# EAGLE design Eagle_Button (EAGLE 7.2.0)
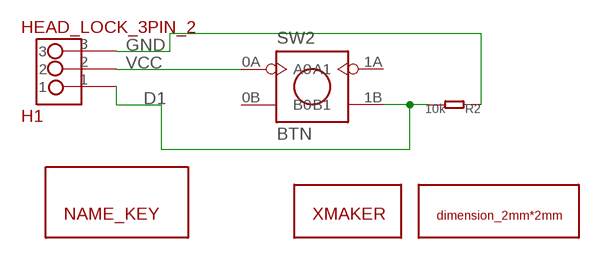
[diagram p0: schematic, sheet 1]

## Parts
H1  HEAD_LOCK_3PIN_2  [HEAD_LOCK_3PIN_2]
R2  10k  005-R0603  [0603]
SW2  BTN  [BTN_8X8]
U$1  XMAKERLOGO  [XMAKERLOGO]
U$3  NAME_KEY  [NAME_KEY]
U$4  DIMENSION_2MM2MM  [DIMENSION_2MM*2MM]

## Nets
D1: H1.1 R2.2 SW2.1B(B1)
GND: H1.3 R2.1
VCC: H1.2 SW2.0A(A0)
Unconnected: SW2.0B(B0) SW2.1A(A1)

## Library data of the parts
H1 = Xmaker:HEAD_LOCK_3PIN_2
R2 = Discrete:005-R*
SW2 = Switch_jumpers:BTN
U$1 = switch-tact:XMAKERLOGO
U$3 = Xmaker:NAME_KEY
U$4 = Xmaker:DIMENSION_2MM*2MM

## Board
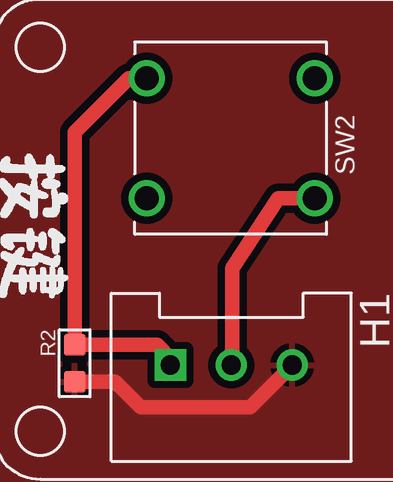
[diagram p1: board, top side]
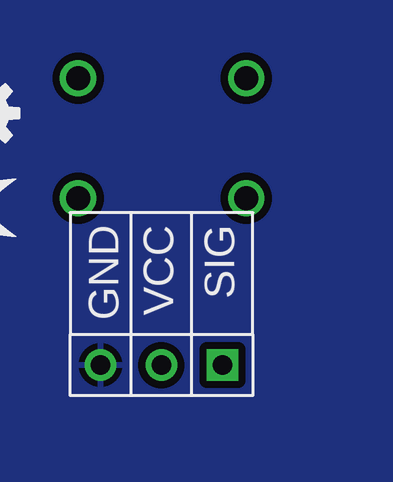
[diagram p2: board, bottom side, seen from below]

No outline drawn. Coordinates in mm, seen from the top.
Copper layers (1*16): Top 0.035mm / dielectric 1.5mm / Bottom 0.035mm
Design rules "SeeedStudio_rule_no_angle_090911": minimum track width 6mil, minimum drill 12mil, track to track 6mil, track to pad 6mil, pad to pad 6mil, via to via 6mil, smd to smd 0mil, copper to edge 10mil, drill to drill 10mil, minimum pad ring 10mil, minimum via ring 6mil, stop-mask expansion 2mil, vias tented up to drill 100mil, thermal gap 10mil

### Footprints (pad centres in the part's own frame; a part is rotated, then mirrored left to right if it is on the bottom)
HEAD_LOCK_3PIN_2 = drill 0.8 square: 1 0,2.54 | drill 0.8: 2 0,0; 3 0,-2.54
0603 = smd 0.889 x 0.889: 1 -0.762,0; 2 0.762,0
BTN_8X8 = drill 1: 0A -3.5,2.5; 0B 3.5,2.5; 1A -3.5,-2.5; 1B 3.5,-2.5

### Placement (x,y rotation side)
H1  9.97,4.8 90 top
R2  3.44,4.87 90 top
SW2  9.95,14.26 180 top
U$1  19.32,13.26 270 bottom
U$2  [OSHW-LOGO-S]  17.41,15.29 270 bottom
U$3  -0.11,10.39 270 top
U$4  0.02,0.05 0 top

### Tracks (layer width: path | path; a pad name or v marks a point on that pad's centre or on a via)
D1
  Top 0.61: SW2.1B 5.69,16.76 3.44,14.51 R2.2 6.88,5.64 7.43,5.09 H1.1
GND
  Top 0.61: R2.1 5.13,4.11 6.2,3.05 10.76,3.05 H1.3
  pour Top (isolate 0.305): -0.36,22.15 19.95,22.27 19.95,-2.37 -0.36,-2.49
  pour Bottom (isolate 0.305): -0.36,22.15 19.95,22.27 19.95,-3 -0.36,-3.13
VCC
  Top 0.61: SW2.0A 11.92,11.76 10.01,8.84 10.01,4.83 H1.2